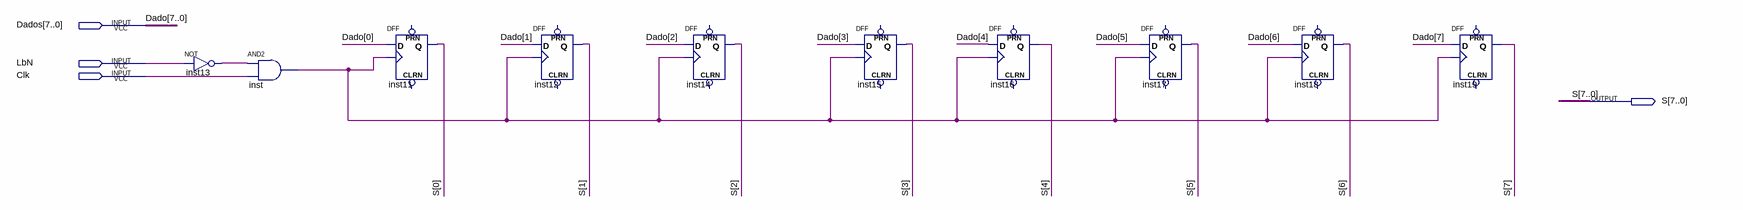
[diagram p0: schematic sheet]
// Quartus schematic RegistradorB.bdf as structural Verilog: 10 symbols, 4 pins
module RegistradorB (
  input  [7:0] Dados,
  input  LbN,
  input  Clk,
  output [7:0] S
);

  wire inst13_out, inst_out;

  not inst13 (inst13_out, LbN);
  and inst (inst_out, inst13_out, Clk);
  DFF inst11 (.CLK(inst_out), .D(Dados[0]), .Q(S[0]));  // open: CLRN, PRN
  DFF inst12 (.CLK(inst_out), .D(Dados[1]), .Q(S[1]));  // open: CLRN, PRN
  DFF inst14 (.CLK(inst_out), .D(Dados[2]), .Q(S[2]));  // open: CLRN, PRN
  DFF inst15 (.CLK(inst_out), .D(Dados[3]), .Q(S[3]));  // open: CLRN, PRN
  DFF inst16 (.CLK(inst_out), .D(Dados[4]), .Q(S[4]));  // open: CLRN, PRN
  DFF inst17 (.CLK(inst_out), .D(Dados[5]), .Q(S[5]));  // open: CLRN, PRN
  DFF inst18 (.CLK(inst_out), .D(Dados[6]), .Q(S[6]));  // open: CLRN, PRN
  DFF inst19 (.CLK(inst_out), .D(Dados[7]), .Q(S[7]));  // open: CLRN, PRN

  // Other names for the same wires on the sheet: Dado[7:0] = Dados
endmodule
